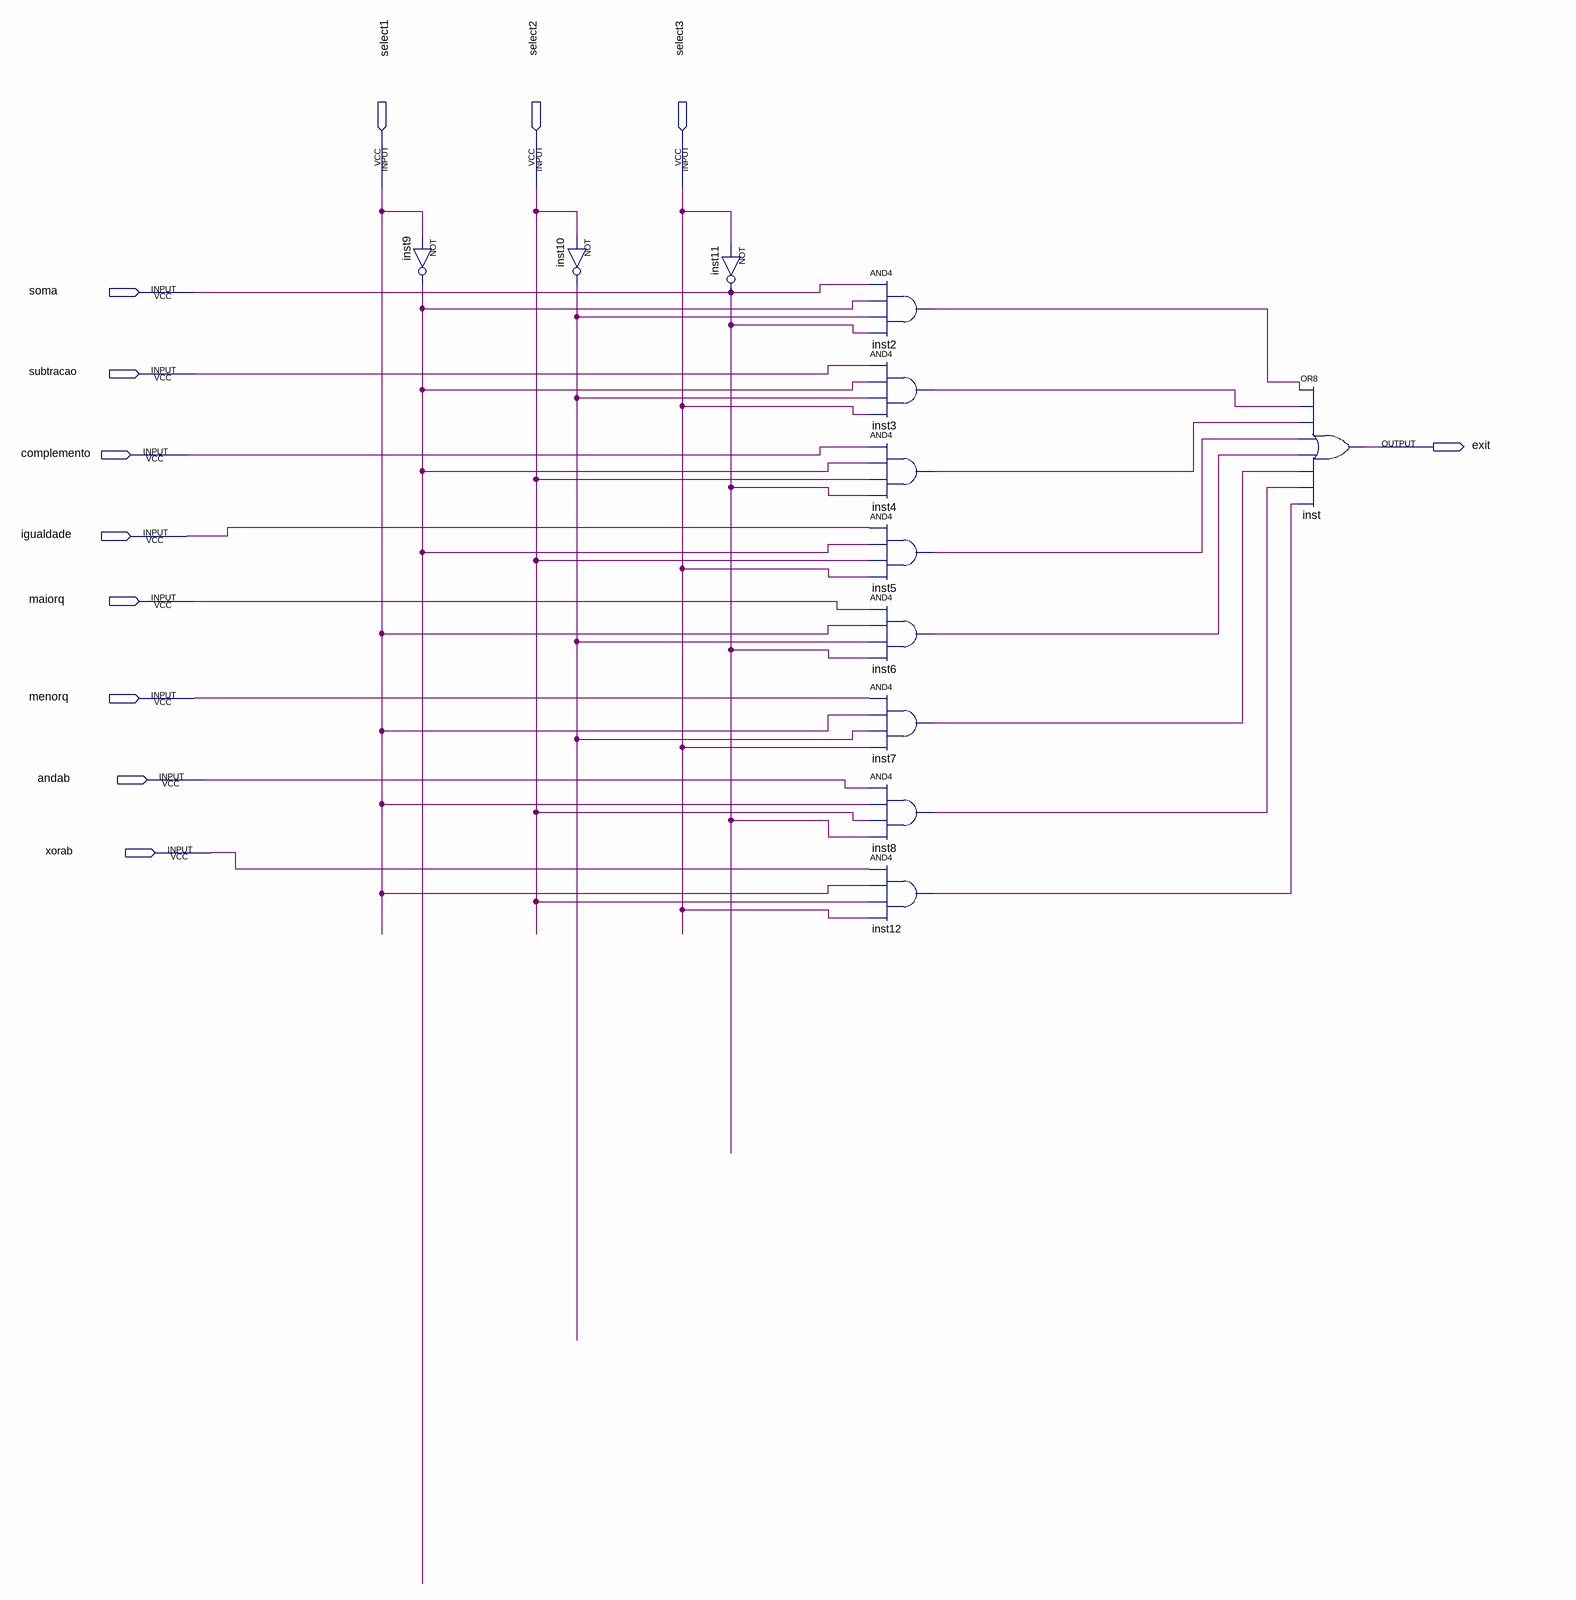
[diagram p0: schematic sheet]
// Quartus schematic muxpequeno.bdf as structural Verilog: 12 symbols, 12 pins
module muxpequeno (
  input  select1,
  input  select2,
  input  select3,
  input  soma,
  input  subtracao,
  input  complemento,
  input  igualdade,
  input  maiorq,
  input  menorq,
  input  andab,
  input  xorab,
  output exit
);

  wire inst2_out, inst3_out, inst4_out, inst5_out, inst6_out, inst7_out, inst8_out, inst9_out, inst10_out,
       inst12_out;

  not inst9 (inst9_out, select1);
  not inst10 (inst10_out, select2);
  not inst11 (soma, select3);
  and inst2 (inst2_out, soma, inst9_out, inst10_out, soma);
  and inst3 (inst3_out, subtracao, inst9_out, inst10_out, select3);
  and inst4 (inst4_out, complemento, inst9_out, select2, soma);
  and inst5 (inst5_out, igualdade, inst9_out, select2, select3);
  and inst6 (inst6_out, maiorq, select1, inst10_out, soma);
  and inst7 (inst7_out, menorq, select1, inst10_out, select3);
  and inst8 (inst8_out, andab, select1, select2, soma);
  and inst12 (inst12_out, xorab, select1, select2, select3);
  or inst (exit, inst2_out, inst3_out, inst4_out, inst5_out, inst6_out, inst7_out, inst8_out, inst12_out);
endmodule
